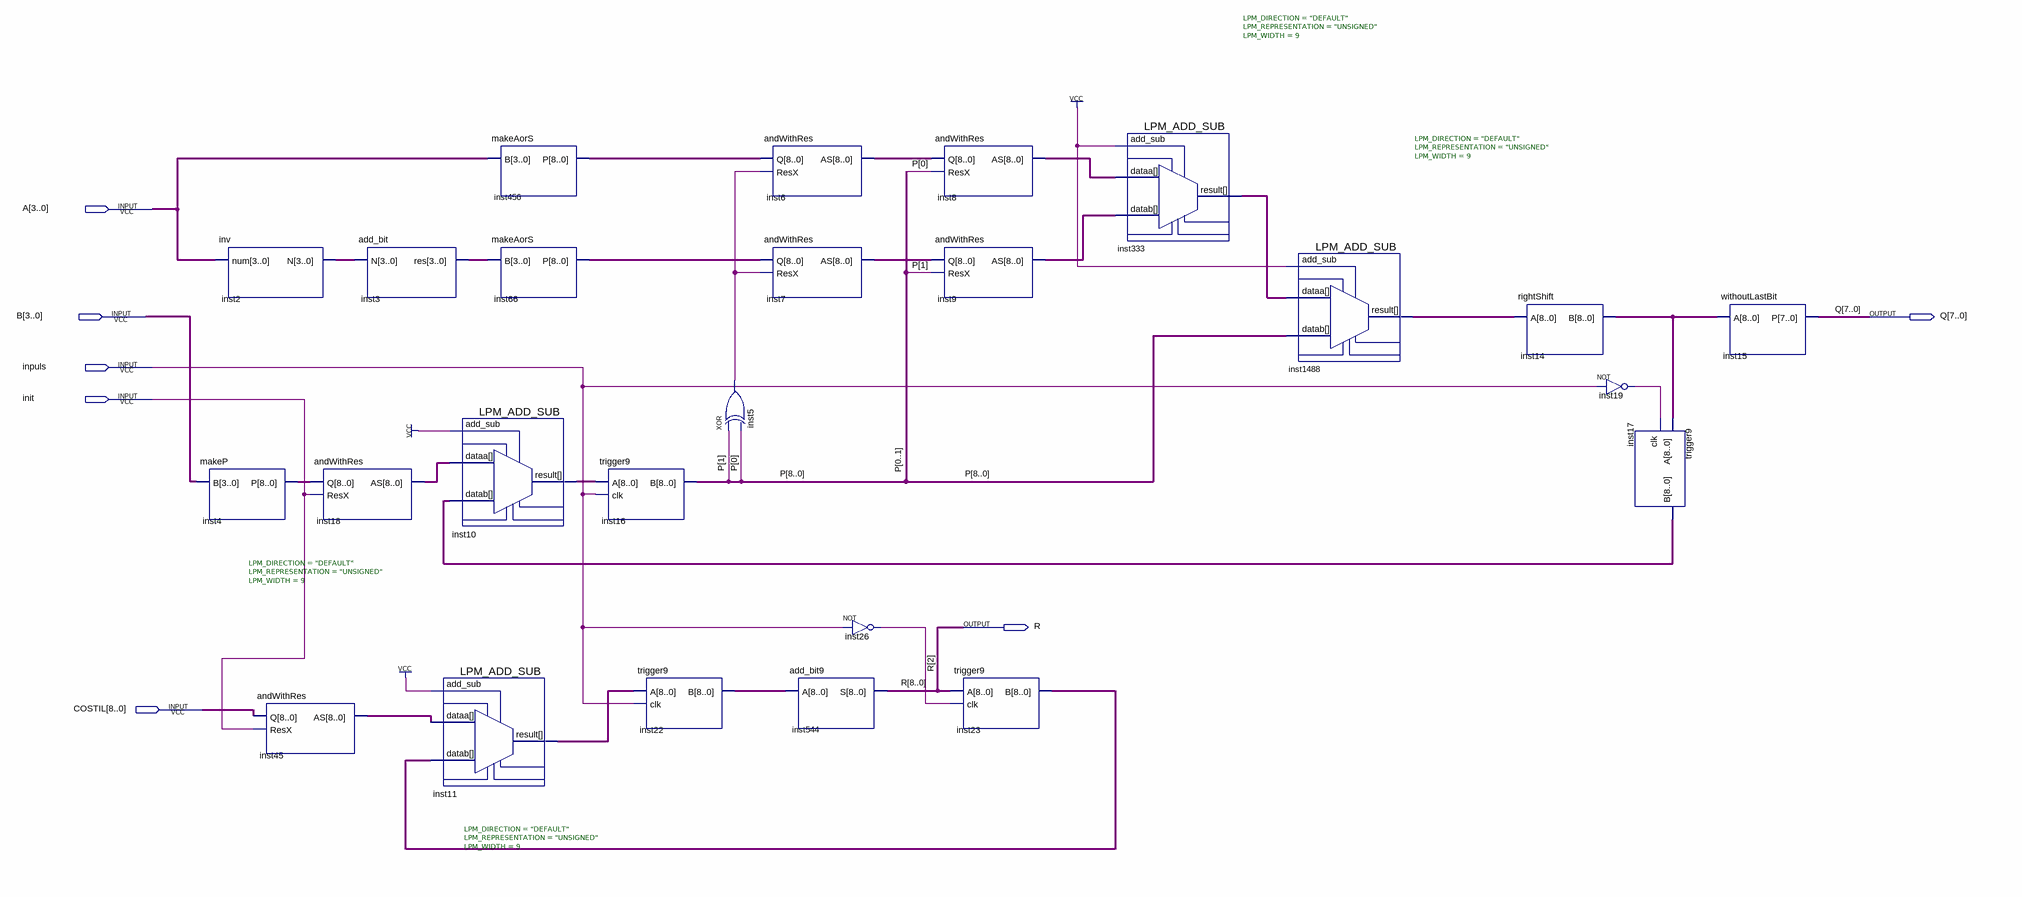
[diagram p0: schematic sheet]
// Quartus schematic lab2.bdf as structural Verilog: 25 symbols, 7 pins
module lab2 (
  input  [3:0] A,
  input  [3:0] B,
  input  inpuls,
  input  init,
  input  [8:0] COSTIL,
  output [7:0] Q,
  output R
);

  wire inst5_out, inst19_out, inst26_out;
  wire [3:0] inst2_n, inst3_res;
  wire [8:0] inst4_p, inst6_as, inst7_as, inst8_as, inst9_as, inst10_result, inst11_result, inst14_b,
       inst17_b, inst18_as, inst22_b, inst23_b, inst45_as, inst66_p, inst333_result, inst456_p,
       inst1488_result, P, R_bus;

  makeP inst4 (.B(B), .P(inst4_p));
  inv inst2 (.num(A), .N(inst2_n));
  andWithRes inst45 (.Q(COSTIL), .ResX(init), .AS(inst45_as));
  andWithRes inst18 (.Q(inst4_p), .ResX(init), .AS(inst18_as));
  add_bit inst3 (.N(inst2_n), .res(inst3_res));
  LPM_ADD_SUB #(.LPM_DIRECTION("DEFAULT"), .LPM_REPRESENTATION("UNSIGNED"), .LPM_WIDTH(9)) inst10 (
    .add_sub(1'b1), .dataa(inst18_as), .datab(inst17_b), .result(inst10_result));
  LPM_ADD_SUB #(.LPM_DIRECTION("DEFAULT"), .LPM_REPRESENTATION("UNSIGNED"), .LPM_WIDTH(9)) inst11 (
    .add_sub(1'b1), .dataa(inst45_as), .datab(inst23_b), .result(inst11_result));
  makeAorS inst456 (.B(A), .P(inst456_p));
  makeAorS inst66 (.B(inst3_res), .P(inst66_p));
  trigger9 inst16 (.A(inst10_result), .clk(inpuls), .B(P));
  trigger9 inst22 (.A(inst11_result), .clk(inpuls), .B(inst22_b));
  xor inst5 (inst5_out, P[1], P[0]);
  andWithRes inst6 (.Q(inst456_p), .ResX(inst5_out), .AS(inst6_as));
  andWithRes inst7 (.Q(inst66_p), .ResX(inst5_out), .AS(inst7_as));
  add_bit9 inst544 (.A(inst22_b), .S({R_bus[8:3], R, R_bus[1:0]}));
  not inst26 (inst26_out, inpuls);
  andWithRes inst8 (.Q(inst6_as), .ResX(P[0]), .AS(inst8_as));
  andWithRes inst9 (.Q(inst7_as), .ResX(P[1]), .AS(inst9_as));
  trigger9 inst23 (.A({R_bus[8:3], R, R_bus[1:0]}), .clk(inst26_out), .B(inst23_b));
  LPM_ADD_SUB #(.LPM_DIRECTION("DEFAULT"), .LPM_REPRESENTATION("UNSIGNED"), .LPM_WIDTH(9)) inst333 (
    .add_sub(1'b1), .dataa(inst8_as), .datab(inst9_as), .result(inst333_result));
  LPM_ADD_SUB #(.LPM_DIRECTION("DEFAULT"), .LPM_REPRESENTATION("UNSIGNED"), .LPM_WIDTH(9)) inst1488 (
    .add_sub(1'b1), .dataa(inst333_result), .datab(P), .result(inst1488_result));
  rightShift inst14 (.A(inst1488_result), .B(inst14_b));
  not inst19 (inst19_out, inpuls);
  trigger9 inst17 (.A(inst14_b), .clk(inst19_out), .B(inst17_b));
  withoutLastBit inst15 (.A(inst14_b), .P(Q));

  // Other names for the same wires on the sheet: R[2] = R
endmodule
